# Altium project Prj_LoRa.PrjPcb
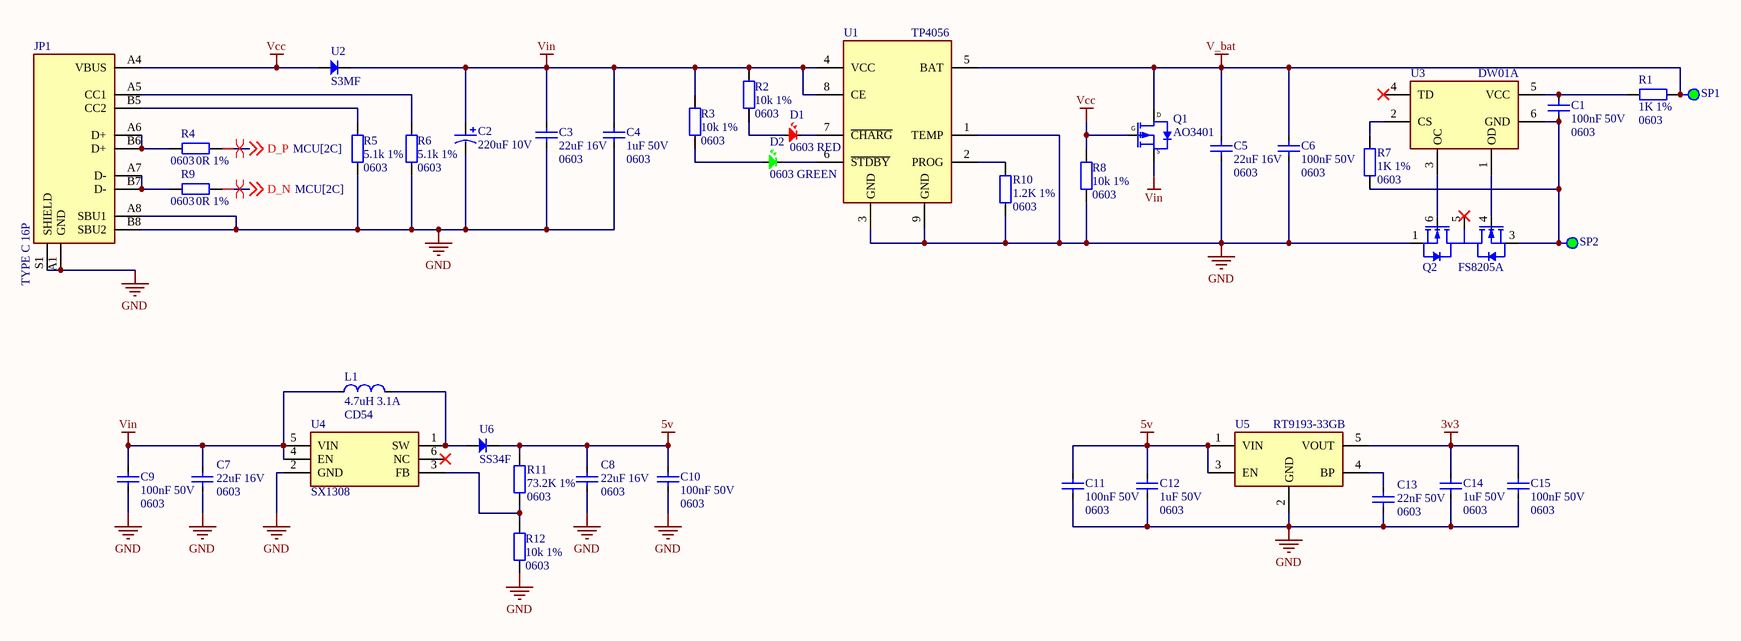
[diagram p0: Voltage_source.SchDoc]
3 sheets, 92 parts. Net scope: global (net labels, ports and power ports of the same name join across sheets).
Board file: Pcb_LoRa.PcbDoc
Sheets:
  Block_diagram.SchDoc
  Voltage_source.SchDoc
  MCU.SchDoc

## Sheet Block_diagram.SchDoc
size A3; SheetNumber: 1; SheetTotal: 3

### Notes on the sheet
- Project Name:
- Author:
- Size:
- Date:
- Sheet Name:
- A3
- Time:
- Checked:
- Approved:
- Rev:
- Sheet:
- of:
- File:

## Sheet Voltage_source.SchDoc
size A3; SheetNumber: 2; SheetTotal: 3

### Parts
C1  100nF 50V  Package: 0603  [C_0603]
C2  220uF 10V  [CAP-ALU-SMD-D-NEW]
C3  22uF 16V  Package: 0603  [C_0603]
C4  1uF 50V  Package: 0603  [C_0603]
C5  22uF 16V  Package: 0603  [C_0603]
C6  100nF 50V  Package: 0603  [C_0603]
C7  22uF 16V  Package: 0603  [C_0603]
C8  22uF 16V  Package: 0603  [C_0603]
C9  100nF 50V  Package: 0603  [C_0603]
C10  100nF 50V  Package: 0603  [C_0603]
C11  100nF 50V  Package: 0603  [C_0603]
C12  1uF 50V  Package: 0603  [C_0603]
C13  22nF 50V  Package: 0603  [C_0603]
C14  1uF 50V  Package: 0603  [C_0603]
C15  100nF 50V  Package: 0603  [C_0603]
D1  0603 RED  [LED0603_RED]
D2  0603 GREEN  [LED0603_GREEN]
JP1  TYPE C 16P  [TYPE C 16P]
L1  4.7uH 3.1A  [CD54]
Q1  AO3401  [SOT23-3]
Q2  FS8205A  [SOT23-6]
R1  1K 1%  Package: 0603  [R_0603]
R2  10k 1%  Package: 0603  [R_0603]
R3  10k 1%  Package: 0603  [R_0603]
R4  0R 1%  Package: 0603  [R_0603]
R5  5.1k 1%  Package: 0603  [R_0603]
R6  5.1k 1%  Package: 0603  [R_0603]
R7  1K 1%  Package: 0603  [R_0603]
R8  10k 1%  Package: 0603  [R_0603]
R9  0R 1%  Package: 0603  [R_0603]
R10  1.2K 1%  Package: 0603  [R_0603]
R11  73.2K 1%  Package: 0603  [R_0603]
R12  10k 1%  Package: 0603  [R_0603]
SP1  SP  [SOLDERING PAD BIG 2]  (value not drawn)
SP2  SP  [SOLDERING PAD BIG 2]  (value not drawn)
U1  TP4056  [ESOP-8]
U2  S3MF  [SMAF_L3.5-W2.6-LS4.7-RD]
U3  DW01A  [SOT23-6]
U4  SX1308  [SOT23-6]
U5  RT9193-33GB  [SOT23-5]
U6  SS34F  [SMAF_L3.5-W2.6-LS4.7-RD]

### Nets
3v3: C14.2 C15.2 U5.5(VOUT)
5v: C8.2 C10.2 C11.2 C12.2 R11.2 U5.1(VIN) U5.3(EN) U6.1
GND: C2.2 C3.1 C4.1 C5.1 C6.1 C7.1 C8.1 C9.1 C10.1 C11.1 C12.1 C13.1 C14.1 C15.1 JP1.A1(GND) JP1.A8(SBU1) JP1.B8(SBU2) JP1.S1(SHIELD) Q2.1(S1) R5.1 R6.1 R8.2 R10.1 R12.1 U1.1(TEMP) U1.3(GND) U1.9(GND) U4.2(GND) U5.2(GND)
V_bat: C5.2 C6.2 Q1.3(D) R1.2 SP1.1 U1.5(BAT)
Vcc: JP1.A4(VBUS) Q1.1(G) R8.1 U2.2
Vin: C2.1 C3.2 C4.2 C7.2 C9.2 L1.1 Q1.2(S) R2.1 R3.1 U1.4(VCC) U1.8(CE) U2.1 U4.4(EN) U4.5(VIN)
D_N: R9.2 ; off-sheet D_N
D_P: R4.2 ; off-sheet D_P
NetC1_1: C1.1 Q2.3(S2) R7.1 SP2.1 U3.6(GND)
NetC1_2: C1.2 R1.1 U3.5(VCC)
NetC13_2: C13.2 U5.4(BP)
NetD1_1: D1.1 R2.2
NetD1_2: D1.2 U1.7(~{CHARG})
NetD2_1: D2.1 R3.2
NetD2_2: D2.2 U1.6(~{STDBY})
NetJP1_A5: JP1.A5(CC1) R6.2
NetJP1_A6: JP1.A6(D+) JP1.B6(D+) R4.1
NetJP1_A7: JP1.A7(D-) JP1.B7(D-) R9.1
NetJP1_B5: JP1.B5(CC2) R5.2
NetL1_2: L1.2 U4.1(SW) U6.2
NetQ2_4: Q2.4(G2) U3.1(OD)
NetQ2_6: Q2.6(G1) U3.3(OC)
NetR7_2: R7.2 U3.2(CS)
NetR10_2: R10.2 U1.2(PROG)
NetR11_1: R11.1 R12.2 U4.3(FB)

Not connected (* = marked no-connect by the designer): Q2 5(D1/D2)*; U3 4(TD)*; U4 6(NC)*

### Layout directives
differential pair: D_N, D_P

### Notes on the sheet
- Project Name:
- Author:
- Size:
- Date:
- Sheet Name:
- A3
- Time:
- Checked:
- Approved:
- Rev:
- Sheet:
- of:
- File:

### Library data of the parts
C1 C6 C9-C11 C15 = C0603_MLCC_100nF_50V: 50V 100nF X7R ±10% 0603 Multilayer Ceramic Capacitors MLCC - SMD/SMT ROHS; Manufacturer: YAGEO; Mrf.Part: CC0603KRX7R9BB104; Packaging: Cut Tape (CT); Link: https://www.lcsc.com/product-detail/Multilayer-Ceramic-Capacitors-MLCC-SMD-SMT_YAGEO-CC0603KRX7R9BB104_C14663.html?s_z=n_100nF%2050V%200603
C2 = C_ALU_220uF_10V_D: 220uF 10V ±20% SMD,D6.3xL7.7mm Aluminum Electrolytic Capacitors - SMD ROHS; Manufacturer: Honor Elec; Mrf.Part: RVT1A221M0607; Packaging: Cut Tape (CT); Link: https://www.lcsc.com/product-detail/Aluminum-Electrolytic-Capacitors-SMD_Honor-Elec-RVT1A221M0607_C87859.html?s_z=n_220uF; Package: D
C3 C5 C7 C8 = C0603_MLCC_22uF_16V: 16V 22uF X5R ±20% 0603 Multilayer Ceramic Capacitors MLCC - SMD/SMT ROHS; Manufacturer: Samsung Electro-Mechanics; Mrf.Part: CL10A226MO7JZNC; Packaging: Cut Tape (CT); Link: https://www.lcsc.com/product-detail/Multilayer-Ceramic-Capacitors-MLCC-SMD-SMT_Samsung-Electro-Mechanics-CL10A226MO7JZNC_C2762594.html?s_z=n_22uF%2050V%200603
C4 C12 C14 = C0603_MLCC_1uF_50V: 1 µF ±10% 50V Ceramic Capacitor X5R 0603 (1608 Metric); Manufacturer: Murata Electronics; Mrf.Part: GRT188R61H105KE13D; Packaging: Cut Tape (CT); Link: https://www.digikey.com/en/products/detail/murata-electronics/GRT188R61H105KE13D/5416752
C13 = C0603_MLCC_22nF_50V: 50V 22nF X7R ±10% 0603 Multilayer Ceramic Capacitors MLCC - SMD/SMT ROHS; Manufacturer: YAGEO; Mrf.Part: CC0603KRX7R9BB223; Packaging: Cut Tape (CT); Link: https://www.lcsc.com/product-detail/C106222.html?s_z=n_Yageo%2520C0603%252022nF; LCSC Part: C106222
D1 = L0603_RED: 20mA 330mcd Colorless Transparent Lens -20℃~+85℃ Positive Stick 620nm~630nm Red 120° 50mW 2.3V 0603 LED Indication - Discrete ROHS; Manufacturer: XINGLIGHT; Mrf.Part: XL-1608SURC-06; Packaging: Cut Tape (CT); Link: https://www.lcsc.com/product-detail/LED-Indication-Discrete_XINGLIGHT-XL-1608SURC-06_C965799.html?s_z=n_LED%200603%20red; Package: 0603
D2 = L0603_GREEN: 225mcd~450mcd Colorless Transparent Lens -40℃~+85℃ Positive Stick 520nm~535nm Green 120° 70mW 2.4V~3V 0603 LED Indication - Discrete ROHS; Manufacturer: Amicc; Mrf.Part: A-SP192DGHC-C01-4T; Packaging: Cut Tape (CT); Link: https://www.lcsc.com/product-detail/LED-Indication-Discrete_Amicc-A-SP192DGHC-C01-4T_C19171301.html?s_z=n_LED%200603%20green; Package: 0603
JP1 = TYPE_C_16P: USB-C (USB TYPE-C) USB 2.0 Receptacle Connector 24 (16+8 Dummy) Position Surface Mount, Right Angle; Through Hole; Manufacturer: Amphenol ICC (Commercial Products); Mrf.Part: 12402012E212A; Packaging: Cut Tape; Link: https://www.digikey.cn/en/products/detail/amphenol-cs-commercial-products/12402012E212A/13683192; Package: Plugin
L1 = CD54_4.7uH_3.1A: 3.1A 4.7uH ±20% SMD,5.8x5.2mm Power Inductors ROHS; Manufacturer: Ceaiya; Mrf.Part: CD54-4R7M; Packaging: Cut Tape; Link: https://www.lcsc.com/product-detail/Power-Inductors_Ceaiya-CD54-4R7M_C7588991.html?s_z=n_cd54%204.7uH; Inductor: 4.7uH; Current: 3.1A; Package: CD54
Q1 = AO3401: 30V 4.2A 42mΩ@10V,4A 1.4W 800mV@250uA 1 Piece P-Channel SOT-23 MOSFETs ROHS; Manufacturer: ElecSuper; Mrf.Part: AO3401; Packaging: Cut Tape (CT); Link: https://www.lcsc.com/product-detail/MOSFETs_ElecSuper-AO3401_C5224195.html; Drain Source Voltage (Vdss): 30V; Continuous Drain Current (Id): 4.2A; Power Dissipation (Pd): 1.4W; Package: SOT23-3
Q2 = FS8205A: 20V 25mΩ@2.5V,3A 1.5W 500mV SOT-23-6 MOSFETs ROHS; Manufacturer: TECH PUBLIC; Manufacture Part Number: FS8205A; Packaging: Cut Tape (CT); Link: https://www.lcsc.com/product-detail/MOSFETs_TECH-PUBLIC-FS8205A_C2830320.html?s_z=n_fs8205; Drain to Source Voltage: 20V; RDS(on): 25mΩ@2.5V,3A; Gate Threshold Voltage (Vgs(th)@Id): 500mV; Package: SOT-23-6
R1 R7 = R0603_1K: 1 kOhms ±1% 0.1W, 1/10W Chip Resistor 0603 (1608 Metric) Moisture Resistant Thick Film; Manufacturer: YAGEO; Mrf.Part: RC0603FR-071KL; Packaging: Cut Tape (CT); Link: https://www.digikey.com/en/products/detail/yageo/RC0603FR-071KL/726843; LCSC Part: C22548; Tolerance: ±1%
R2 R3 R8 R12 = R0603_10k: 100mW Thick Film Resistor 75V ±100ppm/℃ ±1% 10kΩ 0603 Chip Resistor - Surface Mount ROHS; Mrf.Part: RC0603FR-0710KL; Manufacturer: YAGEO; LCSC Part: C98220; Link: https://www.lcsc.com/product-detail/C98220.html?s_z=n_YAgeo%25200603%252010K; Packaging: Cut Tape; Tolerance: ±1%
R4 R9 = R0603_0R: 100mW Thick Film Resistor 75V ±1% 0Ω 0603 Chip Resistor - Surface Mount ROHS; Manufacturer: YAGEO; Mrf.Part: RC0603FR-070RL; Packaging: Cut Tape (CT); Link: https://www.lcsc.com/product-detail/C100044.html?s_z=n_yageo%25200603%25200R%25201%2525; LCSC Part: C100044; Tolerance: ±1%
R5 R6 = R0603_5.1k: 100mW Thick Film Resistor 75V ±100ppm/℃ ±1% 5.1kΩ 0603 Chip Resistor - Surface Mount ROHS; Mrf.Part: RC0603FR-075K1L; Manufacturer: YAGEO; LCSC Part: C105580; Link: https://www.lcsc.com/product-detail/C105580.html?s_z=n_Yageo%25200603%25205.1k%25201%2525; Packaging: Cut Tape; Tolerance: ±1%
R10 = R0603_1.2K: 1.2 kOhms ±1% 0.1W, 1/10W Chip Resistor 0603 (1608 Metric) Moisture Resistant Thick Film; Manufacturer: YAGEO; Mrf.Part: RC0603FR-071K2L; Packaging: Cut Tape (CT); Link: https://www.digikey.com/en/products/detail/yageo/RC0603FR-071K2L/726852; LCSC Part: C114605; Tolerance: ±1%
R11 = R0603_73.2K: 73.2 kOhms ±1% 0.1W, 1/10W Chip Resistor 0603 (1608 Metric) Moisture Resistant Thick Film; Manufacturer: YAGEO; Mrf.Part: RC0603FR-0773K2L; Packaging: Cut Tape (CT); Link: https://www.lcsc.com/product-detail/C163420.html?s_z=n_Yageo%25200603%252073.2K%25201%2525; LCSC Part: C163420; Tolerance: ±1%
SP1 SP2 = SOLDERING PAD
U1 = TP4056: ESOP-8 Battery Management ICs ROHS; Manufacturer: MSKSEMI; Mrf.Part: TP4056-MS; Packaging: Cut Tape (CT); Link: https://www.lcsc.com/product-detail/Battery-Management_MSKSEMI-TP4056-MS_C7473158.html?s_z=n_tp4056; Package: ESOP-8; LCSC Part: C7473158
U2 = S3MF: 3A Independent Type 1.1V@3A 1kV SMAF Diodes - General Purpose ROHS; Manufacturer: Shandong Jingdao Microelectronics; Mrf.Part: S3MF; Packaging: Cut Tape; Link: https://www.lcsc.com/product-detail/Diodes-General-Purpose_Shandong-Jingdao-Microelectronics-S3MF_C123928.html?s_z=n_s3m; Package: SMAF
U3 = DW01A: 1V~5.5V SOT-23-6 Battery Management ROHS; Manufacturer: PJSEMI; Mrf.Part: DW01A; Packaging: Cut Tape (CT); Link: https://www.lcsc.com/product-detail/Battery-Management_PJSEMI-DW01A_C41398501.html?s_z=n_dw01A; Package: SOT-23-6; LCSC Part: C41398501
U4 = SX1308: Boost type Adjustable 28V 2A 2V~24V SOT-23-6 DC-DC Converters ROHS; Manufacturer: SX(Shenzhen Suosemi Tech); Manufacture Part Number: SX1308; Packaging: Cut Tape; Link: https://www.lcsc.com/product-detail/DC-DC-Converters_SX-Shenzhen-Suosemi-Tech-SX1308_C78162.html?s_z=n_sx1308; Package: SOT-23-6
U5 = RT9193-33GB: 300mA -50dB@(10kHz) Fixed 3.3V Positive 5.5V SOT-23-5 Voltage Regulators - Linear, Low Drop Out (LDO) Regulators ROHS; Manufacturer: RICHTEK; Mrf.Part: RT9193-33GB; Packaging: Cut Tape; Link: https://www.lcsc.com/product-detail/C15651.html?s_z=n_RT9193; Package: SOT-23-5; LCSC Part: C15651
U6 = SS34F: 40V Independent Type 3A 700mV@3A SMAF Schottky Diodes ROHS; Manufacturer: HXY MOSFET; Mrf.Part: SS34F; Packaging: Cut Tape; Link: https://www.lcsc.com/product-detail/Schottky-Diodes_HXY-MOSFET-SS34F_C5766642.html?s_z=n_ss34; Package: SMAF

## Sheet MCU.SchDoc
size A3; SheetNumber: 3; SheetTotal: 3
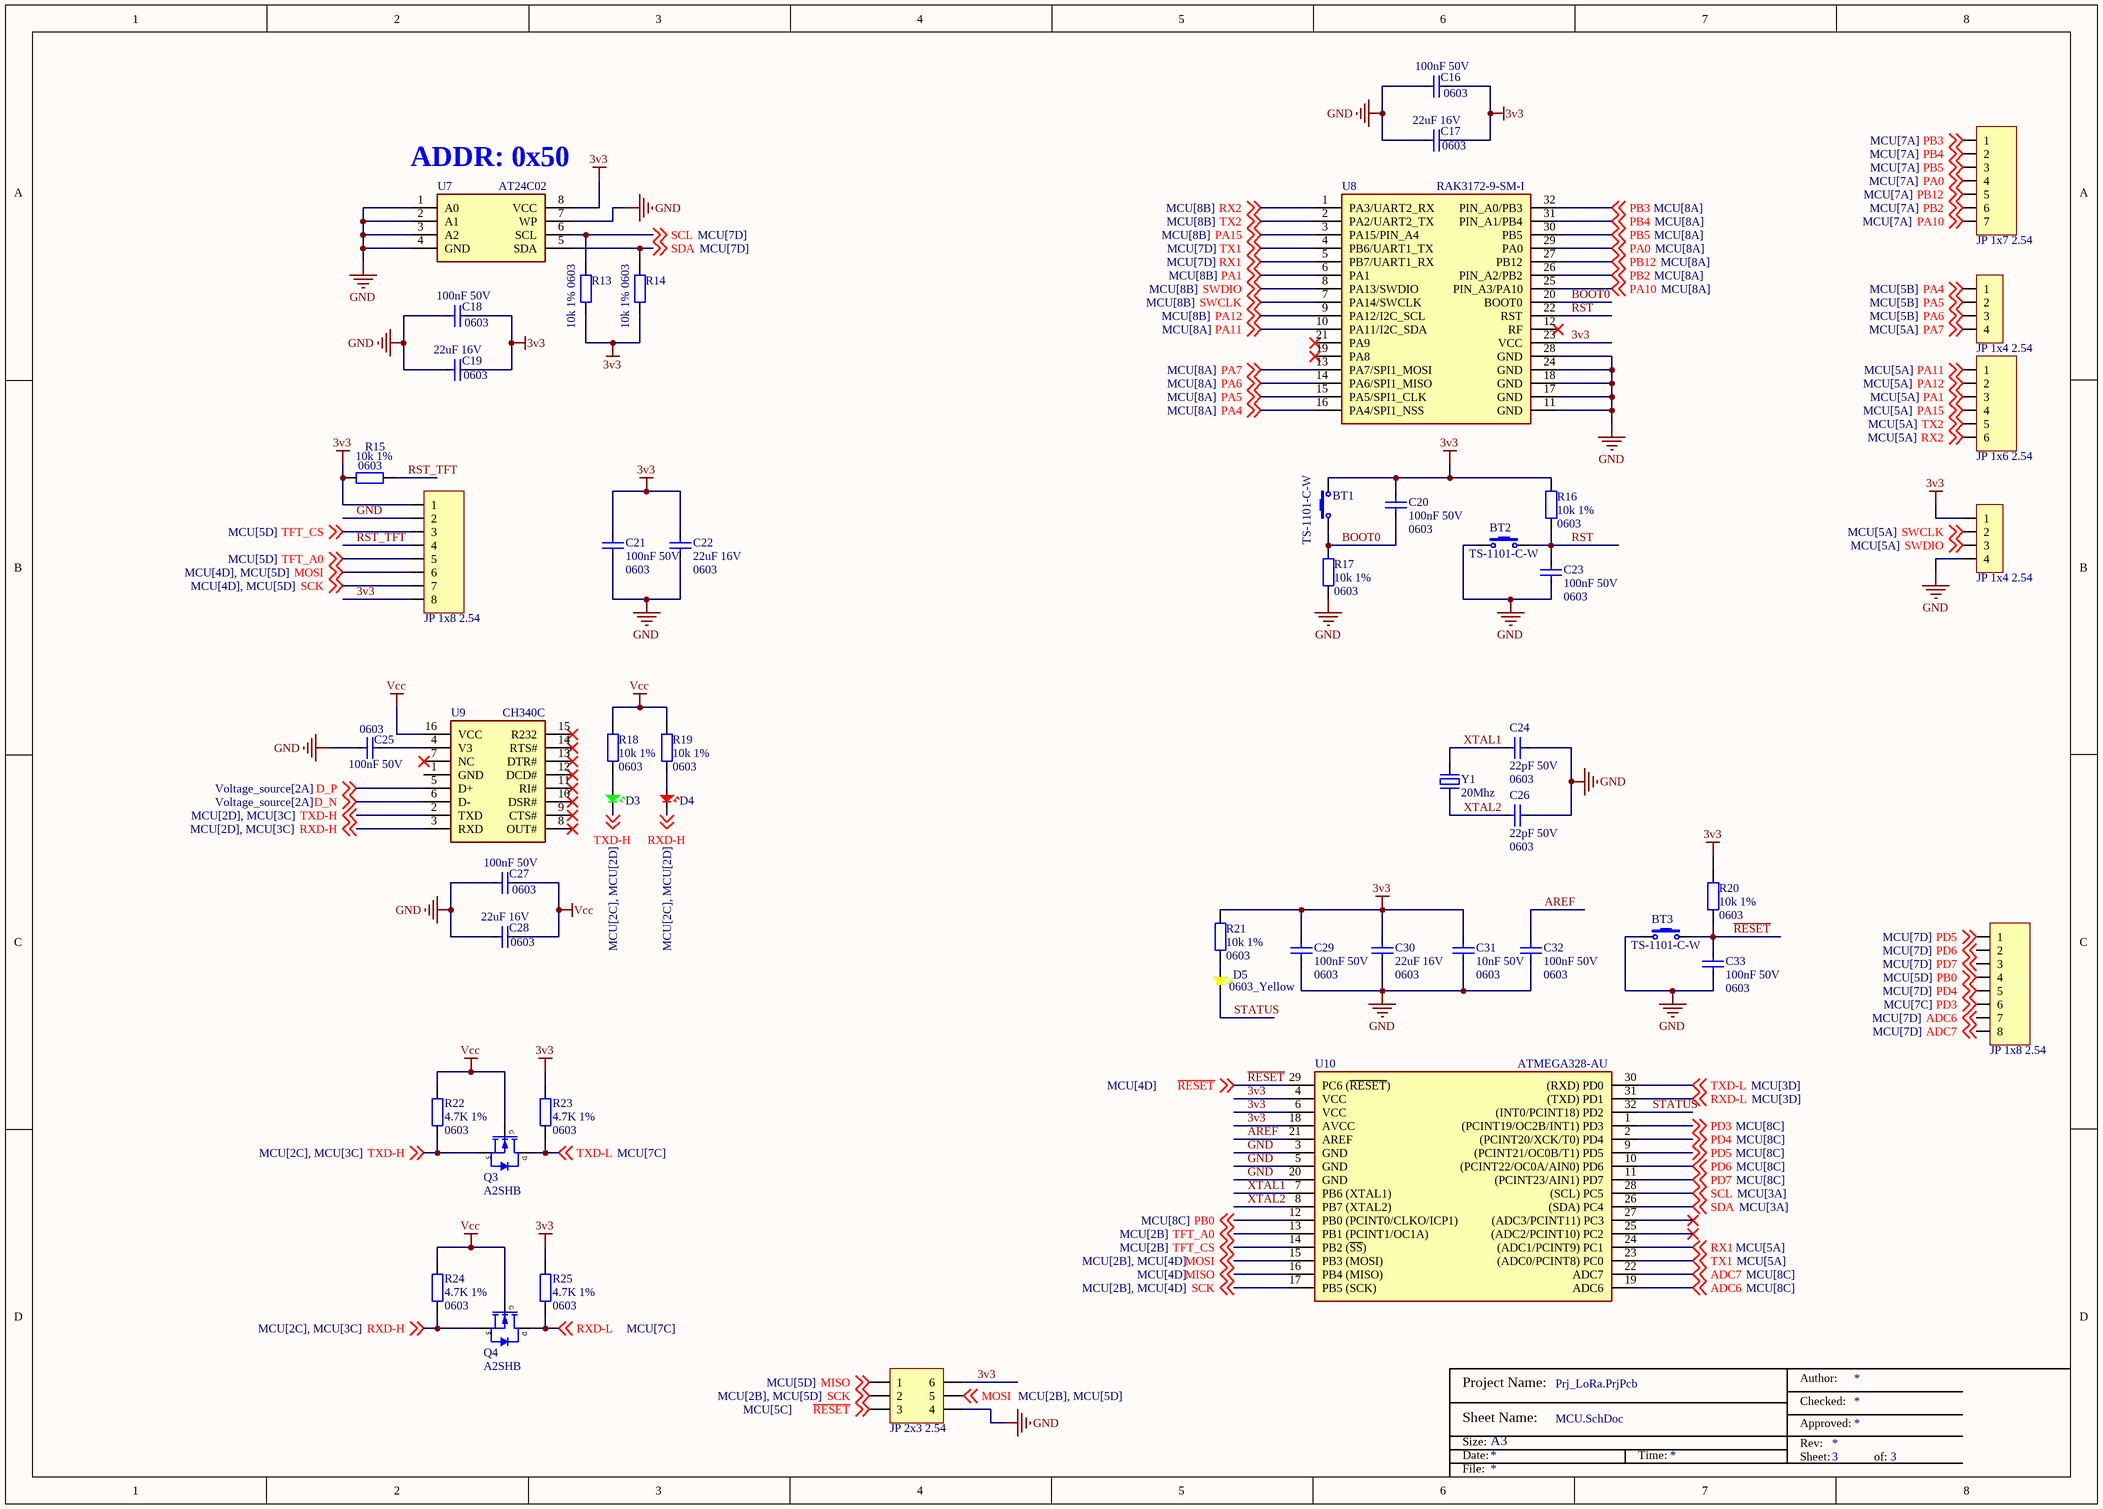
[diagram p1: MCU.SchDoc]

### Parts
BT1  TS-1101-C-W  [button-2P-SMD-6x3x2.5]
BT2  TS-1101-C-W  [button-2P-SMD-6x3x2.5]
BT3  TS-1101-C-W  [button-2P-SMD-6x3x2.5]
C16  100nF 50V  Package: 0603  [C_0603]
C17  22uF 16V  Package: 0603  [C_0603]
C18  100nF 50V  Package: 0603  [C_0603]
C19  22uF 16V  Package: 0603  [C_0603]
C20  100nF 50V  Package: 0603  [C_0603]
C21  100nF 50V  Package: 0603  [C_0603]
C22  22uF 16V  Package: 0603  [C_0603]
C23  100nF 50V  Package: 0603  [C_0603]
C24  22pF 50V  Package: 0603  [C_0603]
C25  100nF 50V  Package: 0603  [C_0603]
C26  22pF 50V  Package: 0603  [C_0603]
C27  100nF 50V  Package: 0603  [C_0603]
C28  22uF 16V  Package: 0603  [C_0603]
C29  100nF 50V  Package: 0603  [C_0603]
C30  22uF 16V  Package: 0603  [C_0603]
C31  10nF 50V  Package: 0603  [C_0603]
C32  100nF 50V  Package: 0603  [C_0603]
C33  100nF 50V  Package: 0603  [C_0603]
D3  0603 GREEN  [LED0603_GREEN]  (value not drawn)
D4  0603 RED  [LED0603_RED]  (value not drawn)
D5  0603_Yellow  [LED0603_YELLOW]
JP2  JP 1x7 2.54  [JP 1x7 CT]
JP3  JP 1x4 2.54  [JP 1x4 CT]
JP4  JP 1x6 2.54  [JP 1x6 CT]
JP5  JP 1x8 2.54  [JP 1x8 CT]
JP6  JP 1x4 2.54  [JP 1x4 CT]
JP7  JP 1x8 2.54  [JP 1x8 CT]
JP8  JP 2x3 2.54  [JP 2x3 DT]
Q3  A2SHB  [SOT23-3]
Q4  A2SHB  [SOT23-3]
R13  10k 1%  Package: 0603  [R_0603]
R14  10k 1%  Package: 0603  [R_0603]
R15  10k 1%  Package: 0603  [R_0603]
R16  10k 1%  Package: 0603  [R_0603]
R17  10k 1%  Package: 0603  [R_0603]
R18  10k 1%  Package: 0603  [R_0603]
R19  10k 1%  Package: 0603  [R_0603]
R20  10k 1%  Package: 0603  [R_0603]
R21  10k 1%  Package: 0603  [R_0603]
R22  4.7K 1%  Package: 0603  [R_0603]
R23  4.7K 1%  Package: 0603  [R_0603]
R24  4.7K 1%  Package: 0603  [R_0603]
R25  4.7K 1%  Package: 0603  [R_0603]
U7  AT24C02  [SOP-8]
U8  RAK3172-9-SM-I  [RAK3172]
U9  CH340C  [CH340C]
U10  ATMEGA328-AU  [TQFP-32(7x7)]
Y1  20Mhz  [HC-49S-SMD]

### Nets
3v3: BT1.2 C16.2 C17.1 C18.2 C19.1 C20.1 C21.2 C22.1 C29.2 C30.1 C31.2 JP5.1 JP5.8 JP6.1 JP8.6 R13.1 R14.1 R15.1 R16.2 R20.2 R21.2 R23.2 R25.2 U7.8(VCC) U8.23(VCC) U10.4(VCC) U10.6(VCC) U10.18(AVCC)
GND: BT2.1 BT3.1 C16.1 C17.2 C18.1 C19.2 C21.1 C22.2 C23.1 C24.1 C25.2 C26.1 C27.1 C28.2 C29.1 C30.2 C31.1 C32.1 C33.1 JP5.2 JP6.4 JP8.4 R17.1 U7.1(A0) U7.2(A1) U7.3(A2) U7.4(GND) U7.7(WP) U8.11(GND) U8.17(GND) U8.18(GND) U8.24(GND) U8.28(GND) U10.3(GND) U10.5(GND) U10.20(GND)
Vcc: C27.2 C28.1 Q3.1(G) Q4.1(G) R18.2 R19.2 R22.2 R24.2 U9.16(VCC)
ADC6: JP7.7 U10.19(ADC6) ; off-sheet ADC6
ADC7: JP7.8 U10.22(ADC7) ; off-sheet ADC7
AREF: C32.2 U10.21(AREF)
BOOT0: BT1.1 C20.2 R17.2 U8.20(BOOT0)
D_N: U9.6(D-) ; off-sheet D_N
D_P: U9.5(D+) ; off-sheet D_P
MISO: JP8.1 U10.16(PB4_(MISO)) ; off-sheet MISO
MOSI: JP5.6 JP8.5 U10.15(PB3_(MOSI)) ; off-sheet MOSI
PA0: JP2.4 U8.29(PA0) ; off-sheet PA0
PA1: JP4.3 U8.6(PA1) ; off-sheet PA1
PA4: JP3.1 U8.16(PA4/SPI1_NSS) ; off-sheet PA4
PA5: JP3.2 U8.15(PA5/SPI1_CLK) ; off-sheet PA5
PA6: JP3.3 U8.14(PA6/SPI1_MISO) ; off-sheet PA6
PA7: JP3.4 U8.13(PA7/SPI1_MOSI) ; off-sheet PA7
PA10: JP2.7 U8.25(PIN_A3/PA10) ; off-sheet PA10
PA11: JP4.1 U8.10(PA11/I2C_SDA) ; off-sheet PA11
PA12: JP4.2 U8.9(PA12/I2C_SCL) ; off-sheet PA12
PA15: JP4.4 U8.3(PA15/PIN_A4) ; off-sheet PA15
PB0: JP7.4 U10.12(PB0_(PCINT0/CLKO/ICP1)) ; off-sheet PB0
PB2: JP2.6 U8.26(PIN_A2/PB2) ; off-sheet PB2
PB3: JP2.1 U8.32(PIN_A0/PB3) ; off-sheet PB3
PB4: JP2.2 U8.31(PIN_A1/PB4) ; off-sheet PB4
PB5: JP2.3 U8.30(PB5) ; off-sheet PB5
PB12: JP2.5 U8.27(PB12) ; off-sheet PB12
PD3: JP7.6 U10.1((PCINT19/OC2B/INT1)_PD3) ; off-sheet PD3
PD4: JP7.5 U10.2((PCINT20/XCK/T0)_PD4) ; off-sheet PD4
PD5: JP7.1 U10.9((PCINT21/OC0B/T1)_PD5) ; off-sheet PD5
PD6: JP7.2 U10.10((PCINT22/OC0A/AIN0)_PD6) ; off-sheet PD6
PD7: JP7.3 U10.11((PCINT23/AIN1)_PD7) ; off-sheet PD7
~{RESET}: BT3.2 C33.2 JP8.3 R20.1 U10.29(PC6_(~{RESET})) ; off-sheet ~{RESET}
RST: BT2.2 C23.2 R16.1 U8.22(RST)
RST_TFT: JP5.4 R15.2
RX1: U8.5(PB7/UART1_RX) U10.24((ADC1/PCINT9)_PC1) ; off-sheet RX1
RX2: JP4.6 U8.1(PA3/UART2_RX) ; off-sheet RX2
RXD-H: D4.2 Q4.2(S) R24.1 U9.3(RXD) ; off-sheet RXD-H
RXD-L: Q4.3(D) R25.1 U10.31((TXD)_PD1) ; off-sheet RXD-L
SCK: JP5.7 JP8.2 U10.17(PB5_(SCK)) ; off-sheet SCK
SCL: R13.2 U7.6(SCL) U10.28((SCL)_PC5) ; off-sheet SCL
SDA: R14.2 U7.5(SDA) U10.26((SDA)_PC4) ; off-sheet SDA
STATUS: D5.2 U10.32((INT0/PCINT18)_PD2)
SWCLK: JP6.2 U8.7(PA14/SWCLK) ; off-sheet SWCLK
SWDIO: JP6.3 U8.8(PA13/SWDIO) ; off-sheet SWDIO
TFT_A0: JP5.5 U10.13(PB1_(PCINT1/OC1A)) ; off-sheet TFT_A0
TFT_CS: JP5.3 U10.14(PB2_(~{SS})) ; off-sheet TFT_CS
TX1: U8.4(PB6/UART1_TX) U10.23((ADC0/PCINT8)_PC0) ; off-sheet TX1
TX2: JP4.5 U8.2(PA2/UART2_TX) ; off-sheet TX2
TXD-H: D3.2 Q3.2(S) R22.1 U9.2(TXD) ; off-sheet TXD-H
TXD-L: Q3.3(D) R23.1 U10.30((RXD)_PD0) ; off-sheet TXD-L
XTAL1: C24.2 U10.7(PB6_(XTAL1)) Y1.2
XTAL2: C26.2 U10.8(PB7_(XTAL2)) Y1.1
NetC25_1: C25.1 U9.4(V3)
NetD3_1: D3.1 R18.1
NetD4_1: D4.1 R19.1
NetD5_1: D5.1 R21.1

Not connected (* = marked no-connect by the designer): U8 12(RF)* 19(PA8)* 21(PA9)*; U9 1(GND) 7(NC)* 8(OUT#)* 9(CTS#)* 10(DSR#)* 11(RI#)* 12(DCD#)* 13(DTR#)* 14(RTS#)* 15(R232)*; U10 25((ADC2/PCINT10)_PC2)* 27((ADC3/PCINT11)_PC3)*

### Notes on the sheet
- (near U7) ADDR: 0x50
- Project Name:
- Author:
- Size:
- Date:
- Sheet Name:
- A3
- Time:
- Checked:
- Approved:
- Rev:
- Sheet:
- of:
- File:

### Library data of the parts
BT1-BT3 = Button-2P: No Without Bracket 50mA 6mm 50,000 Cycles 2.6N 12V 3.6mm 2.5mm Rectangular Button Surface Mount,Vertical SPST SMD Tactile Switches ROHS; Manufacturer: XKB Connection; LCSC Part: C318938; Link: https://www.lcsc.com/product-detail/C318938.html?s_z=n_tactile%2520button; Mrf.Part: TS-1101-C-W; Package: SMD6x3.6x2.5
C16 C18 C20 C21 C23 C25 C27 C29 C32 C33 = C0603_MLCC_100nF_50V: as C1 on sheet Voltage_source; Packaging: Cut Tape (CT); Link: https://www.lcsc.com/product-detail/Multilayer-Ceramic-Capacitors-MLCC-SMD-SMT_YAGEO-CC0603KRX7R9BB104_C14663.html?s_z=n_100nF%2050V%200603
C17 C19 C22 C28 C30 = C0603_MLCC_22uF_16V: as C3 on sheet Voltage_source; Packaging: Cut Tape (CT); Link: https://www.lcsc.com/product-detail/Multilayer-Ceramic-Capacitors-MLCC-SMD-SMT_Samsung-Electro-Mechanics-CL10A226MO7JZNC_C2762594.html?s_z=n_22uF%2050V%200603
C24 C26 = C0603_MLCC_22pF_50V: 50V 22pF NP0 ±5% 0603 Multilayer Ceramic Capacitors MLCC - SMD/SMT ROHS; Manufacturer: YAGEO; Mrf.Part: CC0603JRNPO9BN220; Packaging: Cut Tape (CT); Link: https://www.lcsc.com/product-detail/Multilayer-Ceramic-Capacitors-MLCC-SMD-SMT_YAGEO-CC0603JRNPO9BN220_C105620.html?s_z=n_22pF%2050V%200603
C31 = C0603_MLCC_10nF_50V: 50V 10nF X7R ±10% 0603 Multilayer Ceramic Capacitors MLCC - SMD/SMT ROHS; Manufacturer: YAGEO; Mrf.Part: CC0603KRX7R9BB103; Packaging: Cut Tape (CT); Link: https://www.lcsc.com/product-detail/Multilayer-Ceramic-Capacitors-MLCC-SMD-SMT_YAGEO-CC0603KRX7R9BB103_C100042.html?s_z=n_10nF%2050V%200603
D3 = L0603_GREEN: as D2 on sheet Voltage_source; Packaging: Cut Tape (CT); Link: https://www.lcsc.com/product-detail/LED-Indication-Discrete_Amicc-A-SP192DGHC-C01-4T_C19171301.html?s_z=n_LED%200603%20green; Package: 0603
D4 = L0603_RED: as D1 on sheet Voltage_source; Packaging: Cut Tape (CT); Link: https://www.lcsc.com/product-detail/LED-Indication-Discrete_XINGLIGHT-XL-1608SURC-06_C965799.html?s_z=n_LED%200603%20red; Package: 0603
D5 = L0603_Yellow: 20mA 435mcd Water Clear 585nm~595nm op View Mount Yellow 120° 50mW 2.4V 0603 LED Indication - Discrete ROHS; Mrf.Part: XL-1608UYC-06; Manufacturer: XINGLIGHT; LCSC Part: C965802; Link: https://www.lcsc.com/product-detail/C965802.html?s_z=n_LED%25200603%2520yellow; Package: 0603; Packaging: Cut Tape
JP2 = JP 1x7 2.54 Cai Thang: Cắm; Ten_Linh_Kien: Jump Đơn Cái 2.54MM 1x20P Thẳng; Don_Vi: Con; Ma_Hang: MH004006; Ghi_Chu: *; Kieu_Chan: *; Chung_Loai: Cắm
JP3 JP6 = JP 1x4 2.54 Cai Thang: Cắm; Ten_Linh_Kien: Jump Đơn Cái 2.54MM 1x20P Thẳng; Don_Vi: Con; Ma_Hang: MH004006; Ghi_Chu: *; Kieu_Chan: *; Chung_Loai: Cắm
JP4 = JP 1x6 2.54 Cai Thang: Cắm; Ten_Linh_Kien: Jump Đơn Cái 2.54MM 1x20P Thẳng; Don_Vi: Con; Ma_Hang: MH004006; Ghi_Chu: *; Kieu_Chan: *; Chung_Loai: Cắm
JP5 JP7 = JP 1x8 2.54 Cai Thang: Cắm; Ten_Linh_Kien: Jump Đơn Cái 2.54MM 1x20P Thẳng; Don_Vi: Con; Ma_Hang: MH004006; Ghi_Chu: *; Kieu_Chan: *; Chung_Loai: Cắm
JP8 = JP 2x3 2.54 Duc Thang: Cắm; Ten_Linh_Kien: Jump Đôi Đực 2.54MM 2x40P Thẳng 11MM; Don_Vi: Con; Ma_Hang: MH002686; Ghi_Chu: *; Kieu_Chan: *; Chung_Loai: Cắm
Q3 Q4 = A2SHB: 20V 3A 900mW 60mΩ@4.5V 1V@50uA 1 N-Channel SOT-23 MOSFETs ROHS; Mrf.Part: JSM2302A-A2SHB; Manufacturer: JSMSEMI; LCSC Part: C2905536; Link: https://www.lcsc.com/product-detail/C2905536.html?s_z=n_A2SHB; Package: SOT23-3; Packaging: Cut Tape
R13-R21 = R0603_10k: as R2 on sheet Voltage_source; LCSC Part: C98220; Link: https://www.lcsc.com/product-detail/C98220.html?s_z=n_YAgeo%25200603%252010K; Packaging: Cut Tape; Tolerance: ±1%
R22-R25 = R0603_4.7K: 4.7 kOhms ±1% 0.1W, 1/10W Chip Resistor 0603 (1608 Metric) Moisture Resistant Thick Film; Manufacturer: YAGEO; Mrf.Part: RC0603FR-074K7L; Packaging: Cut Tape (CT); Link: https://www.digikey.com/en/products/detail/yageo/RC0603FR-074K7L/727212; LCSC Part: C99782; Tolerance: ±1%
U7 = AT24C02: 2Kbit 1MHz I2C SOP-8 EEPROM ROHS; Manufacturer: HXY MOSFET; LCSC Part: C7470930; Link: https://www.lcsc.com/product-detail/C7470930.html?s_z=n_AT24C02; Mrf.Part: AT24C02; Package: SOP-8
U8 = RAK3172-9-SM-I: 15km SMD,15.5x15mm LoRa Modules ROHS, with IPEX; Manufacturer: RAKwireless; LCSC Part: C19723905; Link: https://www.lcsc.com/product-detail/C19723905.html?s_z=n_RAK3172; Mrf.Part: RAK3172-9-SM-I; Package: SMD,15.5x15mm
U9 = CH340C: 2Mbps Transceiver USB 2.0 SOP-16 USB Converters ROHS; Manufacturer: WCH; LCSC Part: C84681; Link: https://www.lcsc.com/product-detail/C84681.html?s_z=n_ch340; Mrf.Part: CH340C; Package: SOP-16
U10 = ATMEGA328-AU: AVR 20MHz TQFP-32(7x7) Microcontrollers (MCU/MPU/SOC) ROHS; Manufacturer: MICROCHIP; LCSC Part: C618731; Link: https://www.lcsc.com/product-detail/C618731.html?s_z=n_atmega328; Mrf.Part: ATMEGA328-AU; Package: TQFP-32(7x7)
Y1 = 20Mhz-2P: 20MHz Crystal Oscillator 20pF ±20ppm ±30ppm HC-49S-SMD Crystals ROHS; Mrf.Part: H6OEL89CSC-SUGYLC-20M; Manufacturer: YXC Crystal Oscillators; LCSC Part: C18213020; Link: https://www.lcsc.com/product-detail/C18213020.html?s_z=n_crystal%252020Mhz; Package: HC-49S-SMD

## Nets that join several sheets
3v3: Voltage_source (C14.2 C15.2 U5.5), MCU (28 pins)
GND: Voltage_source (29 pins), MCU (36 pins)
Vcc: Voltage_source (JP1.A4 Q1.1 R8.1 U2.2), MCU (9 pins)
D_N: Voltage_source (R9.2), MCU (U9.6)
D_P: Voltage_source (R4.2), MCU (U9.5)